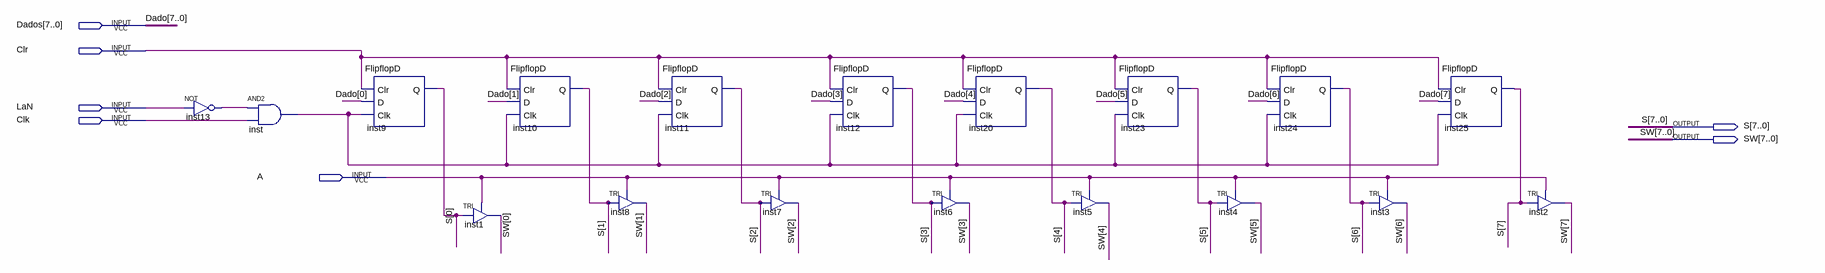
[diagram p0: schematic sheet]
// Quartus schematic accumulator.bdf as structural Verilog: 18 symbols, 7 pins
module accumulator (
  input  [7:0] Dados,
  input  Clr,
  input  LaN,
  input  Clk,
  input  A,
  output [7:0] S,
  output [7:0] SW
);

  wire inst13_out, inst_out;

  not inst13 (inst13_out, LaN);
  and inst (inst_out, inst13_out, Clk);
  FlipflopD inst9 (.Clr(Clr), .D(Dados[0]), .Clk(inst_out), .Q(S[0]));
  TRI inst1 (.IN(S[0]), .OE(A), .OUT(SW[0]));
  FlipflopD inst10 (.Clr(Clr), .D(Dados[1]), .Clk(inst_out), .Q(S[1]));
  TRI inst8 (.IN(S[1]), .OE(A), .OUT(SW[1]));
  FlipflopD inst11 (.Clr(Clr), .D(Dados[2]), .Clk(inst_out), .Q(S[2]));
  TRI inst7 (.IN(S[2]), .OE(A), .OUT(SW[2]));
  FlipflopD inst12 (.Clr(Clr), .D(Dados[3]), .Clk(inst_out), .Q(S[3]));
  TRI inst6 (.IN(S[3]), .OE(A), .OUT(SW[3]));
  FlipflopD inst20 (.Clr(Clr), .D(Dados[4]), .Clk(inst_out), .Q(S[4]));
  TRI inst5 (.IN(S[4]), .OE(A), .OUT(SW[4]));
  FlipflopD inst23 (.Clr(Clr), .D(Dados[5]), .Clk(inst_out), .Q(S[5]));
  TRI inst4 (.IN(S[5]), .OE(A), .OUT(SW[5]));
  FlipflopD inst24 (.Clr(Clr), .D(Dados[6]), .Clk(inst_out), .Q(S[6]));
  TRI inst3 (.IN(S[6]), .OE(A), .OUT(SW[6]));
  FlipflopD inst25 (.Clr(Clr), .D(Dados[7]), .Clk(inst_out), .Q(S[7]));
  TRI inst2 (.IN(S[7]), .OE(A), .OUT(SW[7]));

  // Other names for the same wires on the sheet: Dado[7:0] = Dados
endmodule
